# EAGLE design lm2623 dc converter (EAGLE 5.10)
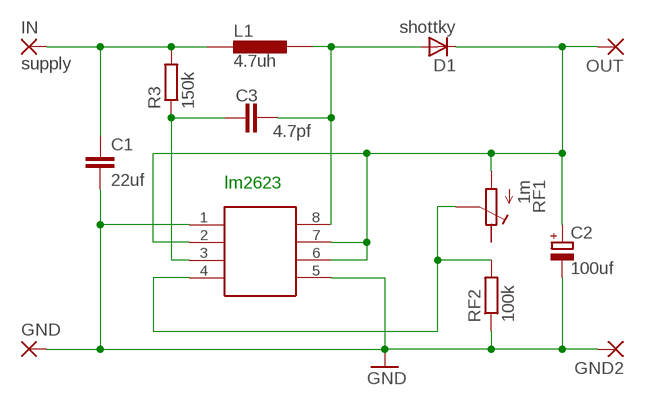
[diagram p0: schematic, sheet 1]

## Parts
C1  22uf  C-EUC1206  [C1206]
C2  100uf  CPOL-EUD  [PANASONIC_D]
C3  4.7pf  C-EUC1206  [C1206]
D1  shottky  BYS10  [SOD106A]
GND  3,17/1,1  [3,17/1,1]
GND2  3,17/1,1  [3,17/1,1]
IN  supply  3,17/1,1  [3,17/1,1]
L1  4.7uh  SMT-INDUCTOR  [SMT-INDUCTOR]
LM2623  lm2623  MINI-SO  [MINI-SO]
OUT  3,17/1,1  [3,17/1,1]
R3  150k  R-EU_M1206  [M1206]
RF1  1m  R-TRIMM  [RTRIM-TE]
RF2  100k  R-EU_M1206  [M1206]

## Nets
GND: C1.2 C2.- GND2.1(P) GND.1(P) LM2623.1 LM2623.5 RF2.1
N$1: C3.1 LM2623.3 R3.1
N$3: LM2623.4 RF1.P$3(S) RF2.2
N$5: C2.+ D1.K LM2623.2 LM2623.6 LM2623.7 OUT.1(P) RF1.P$2(E)
N$9: C3.2 D1.A L1.P$3 LM2623.8
N$10: C1.1 IN.1(P) L1.P$2 R3.2
Unconnected: RF1.P$1(A)

## Notes on the sheet
- lm2623

## Library data of the parts
C1 = resistor:C-EU: CAPACITOR, European symbol
C2 = matt rcl:CPOL-EU: POLARIZED CAPACITOR, European symbol
C3 = matt rcl:C-EU: CAPACITOR, European symbol
D1 = telefunken:BYS10: DIODE
GND GND2 IN OUT = wirepad:3,17/1,1: THROUGH-HOLE PAD
L1 = matt:SMT-INDUCTOR
LM2623 = matt smd-special:MINI-SO: Mini-SO generic format
R3 RF2 = resistor:R-EU_: RESISTOR, European symbol
RF1 = matt:R-TRIMM: Trimm resistor

## Board
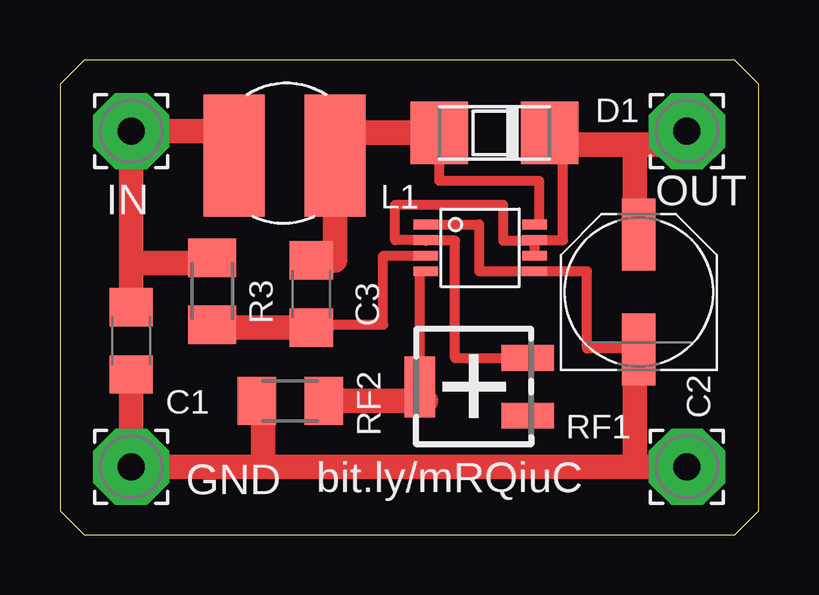
[diagram p1: board, top side]

Size 29.14 x 19.8 mm. Coordinates in mm from the lower left corner, seen from the top.
Outline: 28.14,0 29.14,1 29.14,18.8 28.14,19.8 1,19.8 0,18.8 0,1 1,0 28.14,0
Copper layers (1*16): Top 0.035mm / dielectric 1.5mm / Bottom 0.035mm
Design rules "default": minimum track width 10mil, minimum drill 24mil, track to track 8mil, track to pad 8mil, pad to pad 8mil, via to via 8mil, smd to smd 8mil, copper to edge 40mil, drill to drill 8mil, minimum pad ring 10mil, minimum via ring 8mil, stop-mask expansion 4mil, vias tented up to drill 0mil, thermal gap 10mil

### Footprints (pad centres in the part's own frame; a part is rotated, then mirrored left to right if it is on the bottom)
C1206 = smd 1.6 x 1.8: 1 -1.4,0; 2 1.4,0
PANASONIC_D = smd 3 x 1.4: + 2.4,0; - -2.4,0
SOD106A = smd 2.4 x 2.6: A 2.3,0; K -2.3,0
3,17/1,1 = drill 1.118 pad 3.175 octagon: 1 0,0
SMT-INDUCTOR = smd 2.54 x 5.08: P$2 1,-2.8; P$3 5.2,-2.8
MINI-SO = smd 1.02 x 0.41: 1 0,0; 2 0,-0.65; 3 0,-1.3; 4 0,-1.95; 5 4.55,-1.95; 6 4.55,-1.3; 7 4.55,-0.65; 8 4.55,0
M1206 = smd 1.6 x 2: 1 -1.4,0; 2 1.4,0
RTRIM-TE = smd 1.067 x 2.184: P$1 -1.2,-2.254; P$2 1.2,-2.254 | smd 2.54 x 1.27: P$3 0,2.254

### Placement (x,y rotation side)
C1  2.97,8.09 270 top
C2  24.13,10.12 90 top
C3  10.48,10.04 90 top
D1  18.12,16.76 180 top
GND  2.97,2.83 0 top
GND2  26.14,2.83 0 top
IN  2.97,16.83 0 top
L1  6.27,18.61 0 top
LM2623  15.24,12.94 0 top
OUT  26.14,16.83 0 top
R3  6.35,10.16 90 top
RF1  17.25,6.17 90 top
RF2  9.6,5.59 0 top

### Tracks (layer width: path | path; a pad name or v marks a point on that pad's centre or on a via)
GND
  Top 0.406: C2.- 24.13,7.76 21.98,7.76 21.98,10.99 LM2623.5 17.48,10.99 17.48,12.94 LM2623.1
  Top 1.016: 8.48,2.83 GND.1 C1.2 | 8.48,2.83 23.98,2.83 | 23.98,2.83 GND2.1 | C2.- 23.98,7.72 23.98,2.83 | RF2.1 8.48,5.59 8.48,2.83
N$1
  Top 0.406: LM2623.3 13.48,11.64 13.48,8.76 10.48,8.76 C3.1 | 6.35,8.64 R3.1
  Top 1.016: C3.1 6.35,8.64
N$3
  Top 0.406: 15.25,10.99 LM2623.4 15,10.99 RF1.P$3 15.25,5.59
  Top 1.016: RF2.2 15.25,5.59
N$5
  Top 0.406: LM2623.7 LM2623.6 | LM2623.7 20.98,12.29 20.98,16.26 | RF1.P$2 16.48,7.37 16.48,12.26 15.24,12.26 LM2623.2 13.98,12.29 13.98,13.76 18.48,13.76 18.48,12.26 19.79,12.26 LM2623.7
  Top 1.016: 23.98,16.26 20.98,16.26 D1.K | 23.98,16.26 26.14,16.26 OUT.1 | C2.+ 23.98,12.52 23.98,16.26
N$9
  Top 0.406: LM2623.8 19.98,12.94 19.98,14.76 15.82,14.76 D1.A | C3.2 11.47,11.44 | 11.47,16.76 L1.P$3
  Top 1.016: 11.47,11.44 L1.P$3 | D1.A 11.47,16.76
N$10
  Top 1.016: R3.2 6.35,11.34 2.97,11.34 C1.1 IN.1 7.27,16.83 L1.P$2

### Text on the board
tNames: bit.ly/mRQiuC